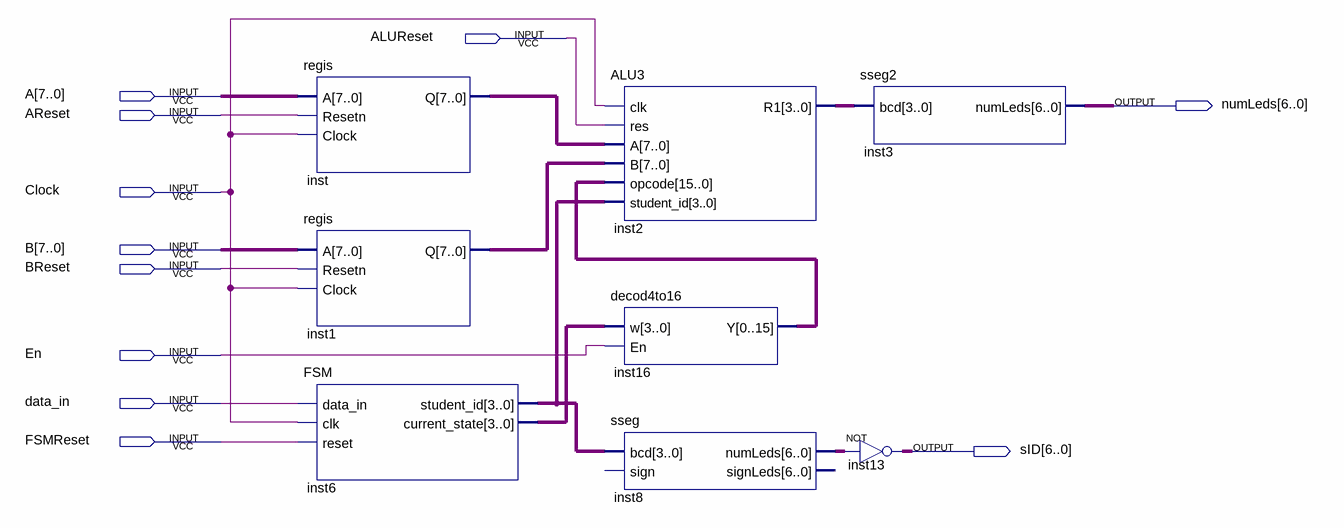
[diagram p0: schematic sheet]
// Quartus schematic lab6part3.bdf as structural Verilog: 8 symbols, 11 pins
module lab6part3 (
  input  ALUReset,
  input  [7:0] A,
  input  AReset,
  input  Clock,
  input  [7:0] B,
  input  BReset,
  input  En,
  input  data_in,
  input  FSMReset,
  output [6:0] numLeds,
  output [6:0] sID
);

  wire [3:0] inst2_r1, inst6_current_state, inst6_student_id;
  wire [6:0] inst8_numleds;
  wire [7:0] inst1_q, inst_q;
  wire [15:0] inst16_y;

  regis inst (.A(A), .Resetn(AReset), .Clock(Clock), .Q(inst_q));
  regis inst1 (.A(B), .Resetn(BReset), .Clock(Clock), .Q(inst1_q));
  FSM inst6 (
    .data_in(data_in), .clk(Clock), .reset(FSMReset), .student_id(inst6_student_id),
    .current_state(inst6_current_state));
  ALU3 inst2 (
    .clk(Clock), .res(ALUReset), .A(inst_q), .B(inst1_q), .opcode(inst16_y), .student_id(inst6_student_id),
    .R1(inst2_r1));
  decod4to16 inst16 (.w(inst6_current_state), .En(En), .Y(inst16_y));
  sseg inst8 (.bcd(inst6_student_id), .numLeds(inst8_numleds));  // open: sign, signLeds
  sseg2 inst3 (.bcd(inst2_r1), .numLeds(numLeds));
  assign sID = ~inst8_numleds;  // NOT inst13, 7 bits wide
endmodule
